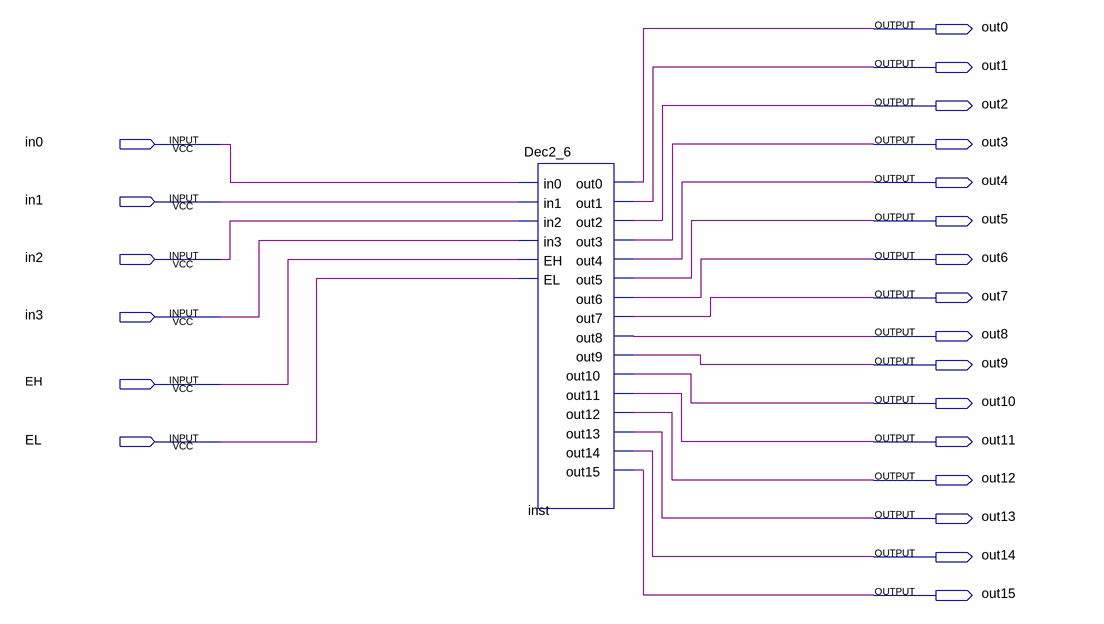
[diagram p0: schematic sheet]
// Quartus schematic Dec2_16demo.bdf as structural Verilog: 1 symbols, 22 pins
module Dec2_16demo (
  input  in0,
  input  in1,
  input  in2,
  input  in3,
  input  EH,
  input  EL,
  output out0,
  output out1,
  output out2,
  output out3,
  output out4,
  output out5,
  output out6,
  output out7,
  output out8,
  output out9,
  output out10,
  output out11,
  output out12,
  output out13,
  output out14,
  output out15
);

  Dec2_6 inst (
    .in0(in0), .in1(in1), .in2(in2), .in3(in3), .EH(EH), .EL(EL), .out0(out0), .out1(out1), .out2(out2),
    .out3(out3), .out4(out4), .out5(out5), .out6(out6), .out7(out7), .out8(out8), .out9(out9), .out10(out10),
    .out11(out11), .out12(out12), .out13(out13), .out14(out14), .out15(out15));
endmodule
